# Altium schematic sheet POWER_DDR3.SchDoc
size Tabloid; SheetNumber: 22; SheetTotal: 25; Sheet_Name: DDR3 POWER; Size: 11x17
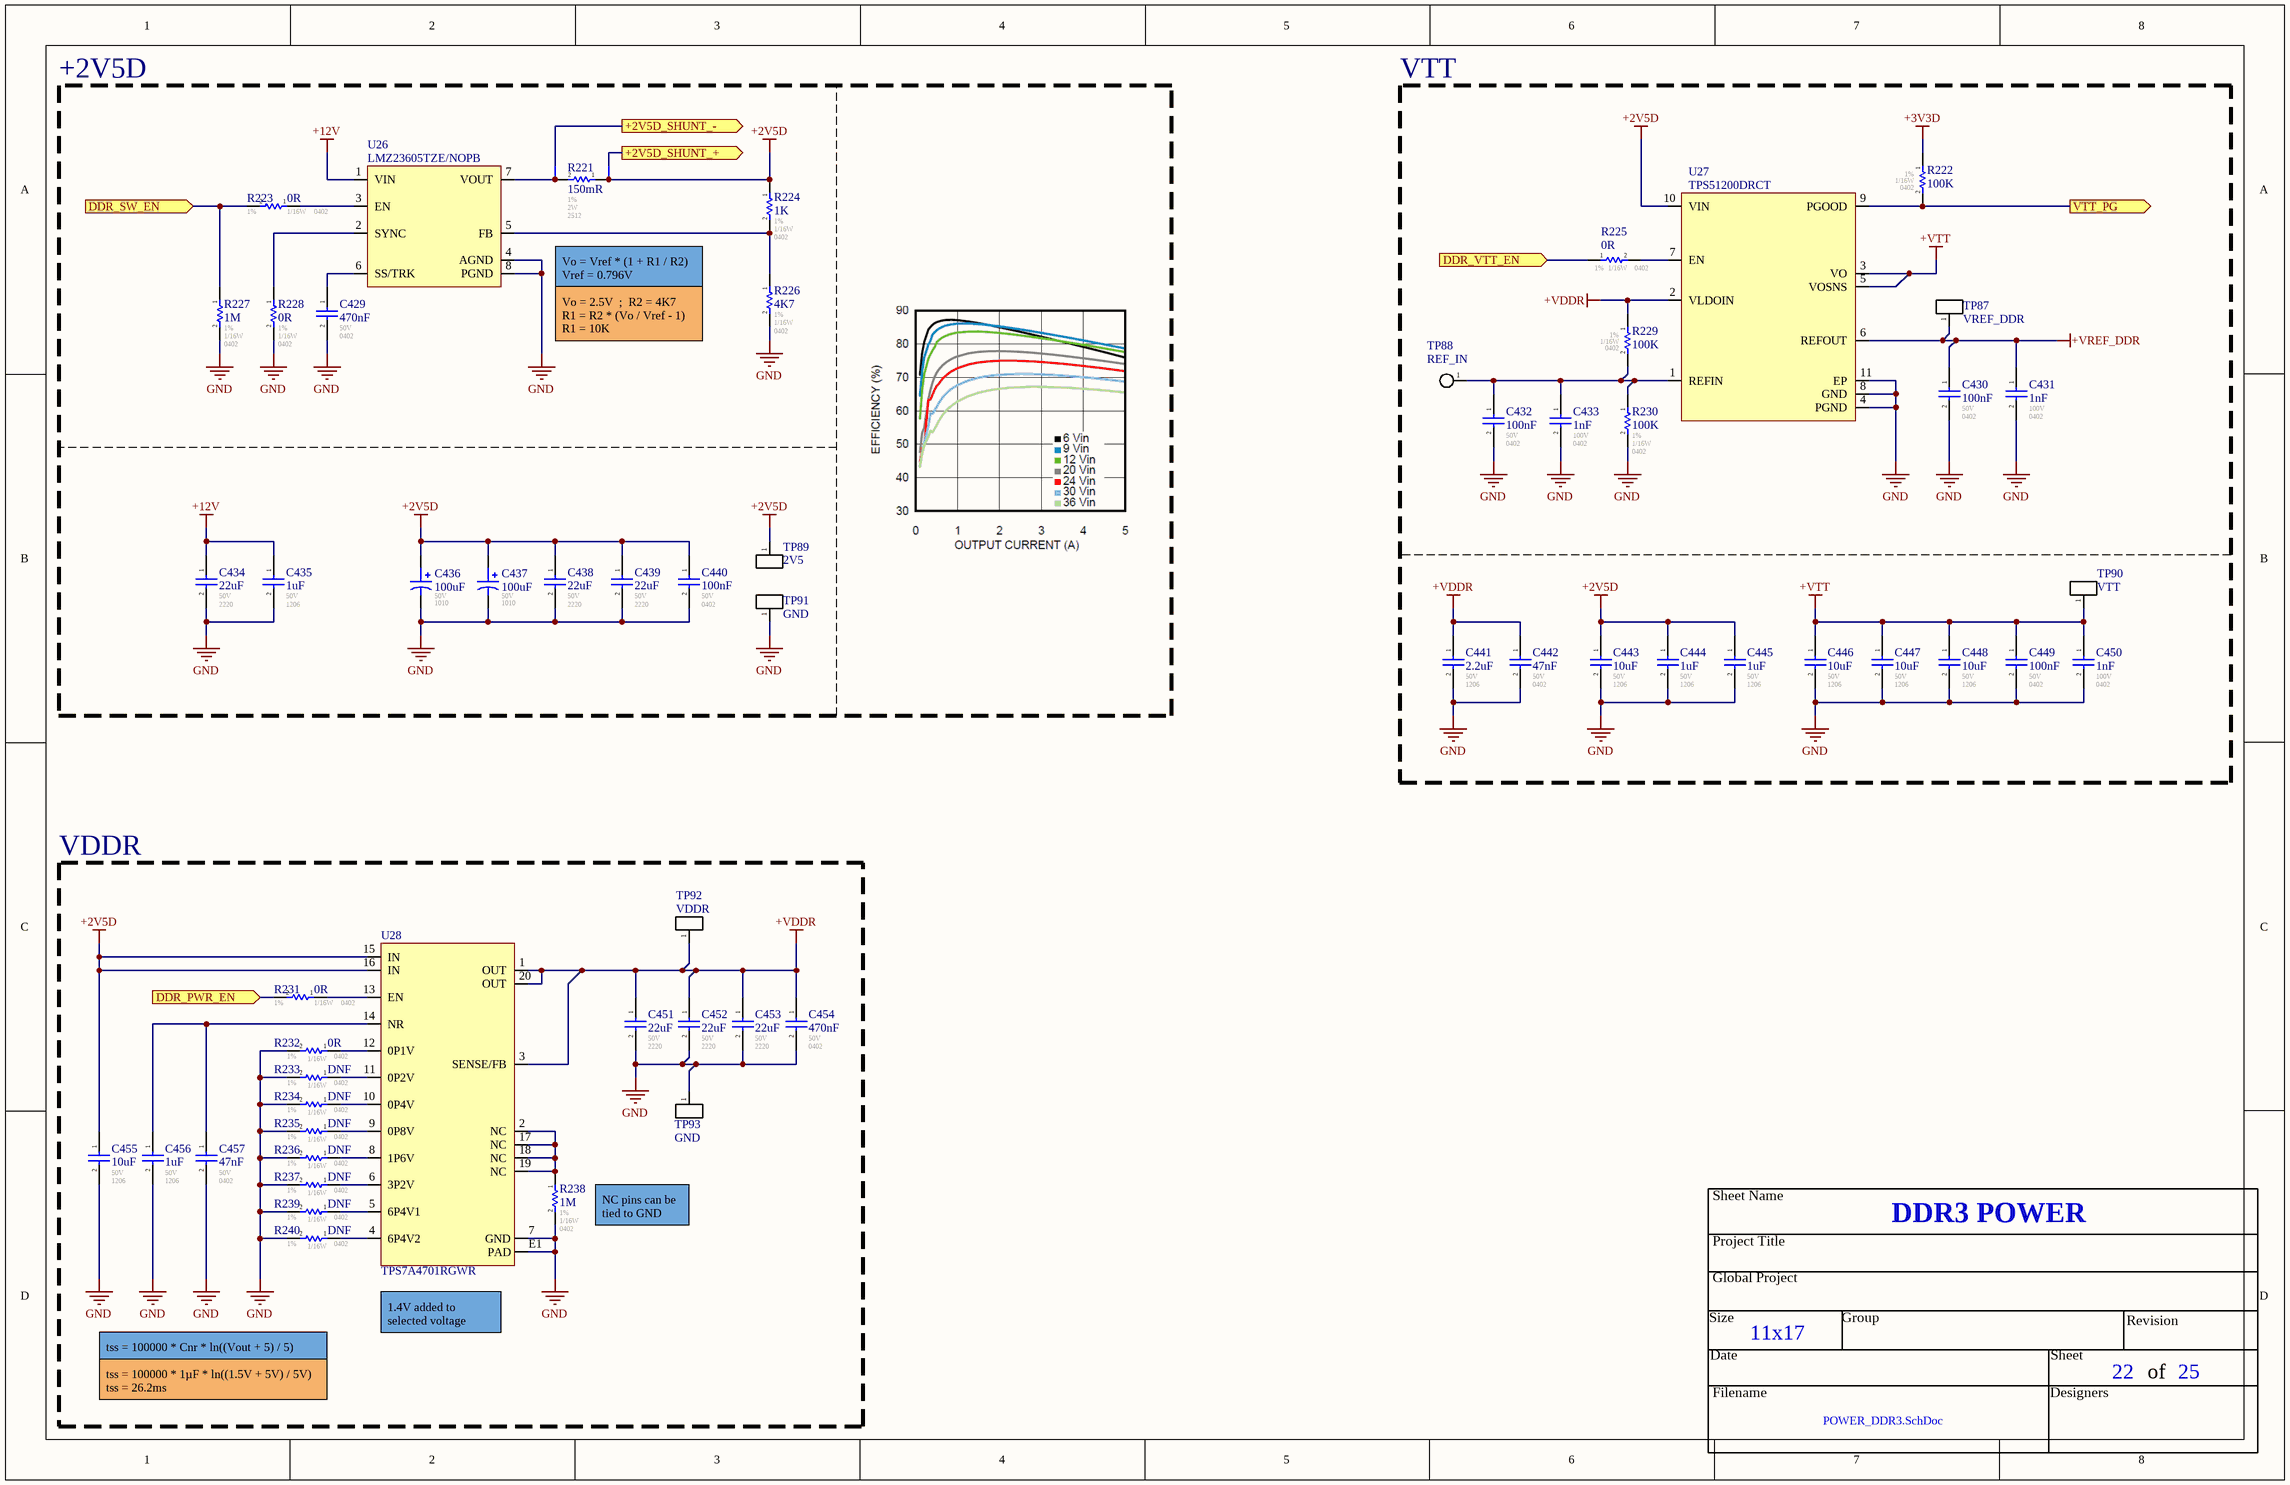
[diagram p0: POWER_DDR3.SchDoc]

## Parts
C429  470nF  Voltage - Rated: 50V  Footprint: 0402  [CAP_0402]
C430  100nF  Voltage - Rated: 50V  Footprint: 0402  [CAP_0402]
C431  1nF  Voltage - Rated: 100V  Footprint: 0402  [CAP_0402]
C432  100nF  Voltage - Rated: 50V  Footprint: 0402  [CAP_0402]
C433  1nF  Voltage - Rated: 100V  Footprint: 0402  [CAP_0402]
C434  22uF  Voltage - Rated: 50V  Footprint: 2220  [CAP_2220]
C435  1uF  Voltage - Rated: 50V  Footprint: 1206  [CAP_1206]
C436  value 100uF  Voltage: 50V  Package: 1010  [CAP_ALU_1010_vishay]  (hidden comment: MAL215099101E3)
C437  value 100uF  Voltage: 50V  Package: 1010  [CAP_ALU_1010_vishay]  (hidden comment: MAL215099101E3)
C438  22uF  Voltage - Rated: 50V  Footprint: 2220  [CAP_2220]
C439  22uF  Voltage - Rated: 50V  Footprint: 2220  [CAP_2220]
C440  100nF  Voltage - Rated: 50V  Footprint: 0402  [CAP_0402]
C441  2.2uF  Voltage - Rated: 50V  Footprint: 1206  [CAP_1206]
C442  47nF  Voltage - Rated: 50V  Footprint: 0402  [CAP_0402]
C443  10uF  Voltage - Rated: 50V  Footprint: 1206  [CAP_1206]
C444  1uF  Voltage - Rated: 50V  Footprint: 1206  [CAP_1206]
C445  1uF  Voltage - Rated: 50V  Footprint: 1206  [CAP_1206]
C446  10uF  Voltage - Rated: 50V  Footprint: 1206  [CAP_1206]
C447  10uF  Voltage - Rated: 50V  Footprint: 1206  [CAP_1206]
C448  10uF  Voltage - Rated: 50V  Footprint: 1206  [CAP_1206]
C449  100nF  Voltage - Rated: 50V  Footprint: 0402  [CAP_0402]
C450  1nF  Voltage - Rated: 100V  Footprint: 0402  [CAP_0402]
C451  22uF  Voltage - Rated: 50V  Footprint: 2220  [CAP_2220]
C452  22uF  Voltage - Rated: 50V  Footprint: 2220  [CAP_2220]
C453  22uF  Voltage - Rated: 50V  Footprint: 2220  [CAP_2220]
C454  470nF  Voltage - Rated: 50V  Footprint: 0402  [CAP_0402]
C455  10uF  Voltage - Rated: 50V  Footprint: 1206  [CAP_1206]
C456  1uF  Voltage - Rated: 50V  Footprint: 1206  [CAP_1206]
C457  47nF  Voltage - Rated: 50V  Footprint: 0402  [CAP_0402]
NT44  Net Tie  [NETTIE_5]  (value not drawn)  (net tie, no BOM)
NT45  Net Tie  [NETTIE_5]  (value not drawn)  (net tie, no BOM)
R221  150mR  Tolerance: 1%  Power: 2W  Package / Case: 2512  [RES_2512]
R222  100K  Tolerance: 1%  Power: 1/16W  Package / Case: 0402  [RES_0402]
R223  0R  Tolerance: 1%  Power: 1/16W  Package / Case: 0402  [RES_0402]
R224  1K  Tolerance: 1%  Power: 1/16W  Package / Case: 0402  [RES_0402]
R225  0R  Tolerance: 1%  Power: 1/16W  Package / Case: 0402  [RES_0402]
R226  4K7  Tolerance: 1%  Power: 1/16W  Package / Case: 0402  [RES_0402]
R227  1M  Tolerance: 1%  Power: 1/16W  Package / Case: 0402  [RES_0402]
R228  0R  Tolerance: 1%  Power: 1/16W  Package / Case: 0402  [RES_0402]
R229  100K  Tolerance: 1%  Power: 1/16W  Package / Case: 0402  [RES_0402]
R230  100K  Tolerance: 1%  Power: 1/16W  Package / Case: 0402  [RES_0402]
R231  0R  Tolerance: 1%  Power: 1/16W  Package / Case: 0402  [RES_0402]
R232  0R  Tolerance: 1%  Power: 1/16W  Package / Case: 0402  [RES_0402]
R233  DNF  Tolerance: 1%  Power: 1/16W  Package / Case: 0402  [RES_0402]
R234  DNF  Tolerance: 1%  Power: 1/16W  Package / Case: 0402  [RES_0402]
R235  DNF  Tolerance: 1%  Power: 1/16W  Package / Case: 0402  [RES_0402]
R236  DNF  Tolerance: 1%  Power: 1/16W  Package / Case: 0402  [RES_0402]
R237  DNF  Tolerance: 1%  Power: 1/16W  Package / Case: 0402  [RES_0402]
R238  1M  Tolerance: 1%  Power: 1/16W  Package / Case: 0402  [RES_0402]
R239  DNF  Tolerance: 1%  Power: 1/16W  Package / Case: 0402  [RES_0402]
R240  DNF  Tolerance: 1%  Power: 1/16W  Package / Case: 0402  [RES_0402]
TP87  VREF_DDR  [TP_HOLE]  (no BOM)
TP88  REF_IN  [TP_PAD_SMALL]  (no BOM)
TP89  2V5  [TP_HOLE]  (no BOM)
TP90  VTT  [TP_HOLE]  (no BOM)
TP91  GND  [TP_HOLE]  (no BOM)
TP92  VDDR  [TP_HOLE]  (no BOM)
TP93  GND  [TP_HOLE]  (no BOM)
U26  LMZ23605TZE/NOPB  [REG_SWR_LMZ23605TZE/NOPB]
U27  TPS51200DRCT  [REG_PMIC_TPS51200DRCT]
U28  TPS7A4701RGWR  [REG_TPS7A4701RGWR]

## Blocks framed on the sheet
+2V5D: C429 C434-C440 NT44 NT45 R221 R223 R224 R226-R228 TP89 TP91 U26
VTT: C430-C433 C441-C450 R222 R225 R229 R230 TP87 TP88 TP90 U27
VDDR: C451-C457 R231-R240 TP92 TP93 U28

## Ports
+2V5D_SHUNT_+ (out), +2V5D_SHUNT_- (out), DDR_PWR_EN (in), DDR_SW_EN (in), DDR_VTT_EN (in), VTT_PG (out)

## Nets
+2V5D: C436.1 C437.1 C438.1 C439.1 C440.1 C443.1 C444.1 C445.1 C455.1 NT45.1 R221.1 R224.1 TP89.1(A) U27.10(VIN) U28.15(IN) U28.16(IN)
+3V3D: R222.1
+12V: C434.1 C435.1 U26.1(VIN)
+VDDR: C441.1 C442.1 C451.1 C452.1 C453.1 C454.1 R229.1 TP92.1(A) U27.2(VLDOIN) U28.1(OUT) U28.3(SENSE/FB) U28.20(OUT)
+VREF_DDR: C430.1 C431.1 TP87.1(A) U27.6(REFOUT)
+VTT: C446.1 C447.1 C448.1 C449.1 C450.1 TP90.1(A) U27.3(VO) U27.5(VOSNS)
GND: C429.2 C430.2 C431.2 C432.2 C433.2 C434.2 C435.2 C436.2 C437.2 C438.2 C439.2 C440.2 C441.2 C442.2 C443.2 C444.2 C445.2 C446.2 C447.2 C448.2 C449.2 C450.2 C451.2 C452.2 C453.2 C454.2 C455.2 C456.2 C457.2 R226.2 R227.2 R228.2 R230.2 R232.2 R233.2 R234.2 R235.2 R236.2 R237.2 R238.2 R239.2 R240.2 TP91.1(A) TP93.1(A) U26.4(AGND) U26.8(PGND) U27.4(PGND) U27.8(GND) U27.11(EP) U28.7(GND) U28.E1(PAD)
+2V5D_SHUNT_+: NT45.2 ; port +2V5D_SHUNT_+
+2V5D_SHUNT_-: NT44.2 ; port +2V5D_SHUNT_-
DDR_PWR_EN: R231.2 ; port DDR_PWR_EN
DDR_SW_EN: R223.2 R227.1 ; port DDR_SW_EN
DDR_VTT_EN: R225.1 ; port DDR_VTT_EN
VTT_PG: R222.2 U27.9(PGOOD) ; port VTT_PG
NetC429_1: C429.1 U26.6(SS/TRK)
NetC432_1: C432.1 C433.1 R229.2 R230.1 TP88.1(A) U27.1(REFIN)
NetC456_1: C456.1 C457.1 U28.14(NR)
NetNT44_1: NT44.1 R221.2 U26.7(VOUT)
NetR223_1: R223.1 U26.3(EN)
NetR224_2: R224.2 R226.1 U26.5(FB)
NetR225_2: R225.2 U27.7(EN)
NetR228_1: R228.1 U26.2(SYNC)
NetR231_1: R231.1 U28.13(EN)
NetR232_1: R232.1 U28.12(0P1V)
NetR233_1: R233.1 U28.11(0P2V)
NetR234_1: R234.1 U28.10(0P4V)
NetR235_1: R235.1 U28.9(0P8V)
NetR236_1: R236.1 U28.8(1P6V)
NetR237_1: R237.1 U28.6(3P2V)
NetR238_1: R238.1 U28.2(NC) U28.17(NC) U28.18(NC) U28.19(NC)
NetR239_1: R239.1 U28.5(6P4V1)
NetR240_1: R240.1 U28.4(6P4V2)

## Notes on the sheet
- Vo = Vref * (1 + R1 / R2)
  Vref = 0.796V
- Vo = 2.5V  ;  R2 = 4K7
  R1 = R2 * (Vo / Vref - 1)
  R1 = 10K
- (near R238) NC pins can be tied to GND
- tss = 100000 * Cnr * ln((Vout + 5) / 5)
- (near U28) 1.4V added to selected voltage
- tss = 100000 * 1µF * ln((1.5V + 5V) / 5V)
  tss = 26.2ms
- Sheet Name
- Project Title
- Global Project
- Revision
- Size
- Date
- Group
- Sheet
- of
- Filename
- Designers

## Library data of the parts
C429 C454 = CAP_CER: CGA3E3X7R1H474K080AB / 0603 470nF 10% X7R Ceramic Capacitor; Mfr: TDK; Operating Temperature: -55C - 125C; Temperature Coefficient: X7R; ComponentLink1Description: Digikey; ComponentLink1URL: [Digikey Link]; Part#: CGA3E3X7R1H474K080AB; ComponentLink2Description: Datasheet; ComponentLink2URL: [Datasheet Link]; Tolerance: 10%; Ratings: AEC-Q200
C430 C432 C440 C449 = CAP_CER: GCM155R71H104KE02J / 0402 100nF 10% X7R Ceramic Capacitor; Mfr: Murata; Operating Temperature: -55C - 125C; Temperature Coefficient: X7R; ComponentLink1Description: Digikey; ComponentLink1URL: [Digikey Link]; Part#: GCM155R71H104KE02J; ComponentLink2Description: Datasheet; ComponentLink2URL: [Datasheet Link]; Tolerance: 10%; Ratings: AEC-Q200
C431 C433 C450 = CAP_CER: GCM155R72A102KA37D / 0402 1nF 10% X7R Ceramic Capacitor; Mfr: Murata; Operating Temperature: -55C - 125C; Temperature Coefficient: X7R; ComponentLink1Description: Digikey; ComponentLink1URL: [Digikey Link]; Part#: GCM155R72A102KA37D; ComponentLink2Description: Datasheet; ComponentLink2URL: [Datasheet Link]; Tolerance: 10%; Ratings: AEC-Q200
C434 C438 C439 C451-C453 = CAP_CER: CGA9P3X7R1H226M250KB / 2220 22uF 20% X7R Ceramic Capacitor; Mfr: TDK; Operating Temperature: -55C - 125C; Temperature Coefficient: X7R; ComponentLink1Description: Digikey; ComponentLink1URL: https://www.digikey.ca/en/products/detail/tdk-corporation/CGA9P3X7R1H226M250KB/10240627; ComponentLink2Description: Datasheet; ComponentLink2URL: https://product.tdk.com/system/files/dam/doc/product/capacitor/ceramic/mlcc/charasheet/cga9p3x7r1h226m250kb.pdf; Tolerance: 20%; Ratings: AEC-Q200; Part#: CGA9P3X7R1H226M250KB; Supplier 1: Arrow Electronics; Supplier Part Number 1: CGA9P3X7R1H226M250KB; ComponentLink3Description: TDK; ComponentLink3URL: https://product.tdk.com/en/search/capacitor/ceramic/mlcc/info?part_no=CGA9P3X7R1H226M250KB; ComponentLink4Description: Octopart; ComponentLink4URL: https://octopart.com/cga9p3x7r1h226m250kb-tdk-102764996?r=sp
C435 C444 C445 C456 = CAP_CER: GCJ31CR71H105KA12L / 1206 1uF 10% X7R Ceramic Capacitor; Mfr: Murata; Operating Temperature: -55C - 125C; Temperature Coefficient: X7R; ComponentLink1Description: Digikey; ComponentLink1URL: [Digikey Link]; Part#: GCJ31CR71H105KA12L; ComponentLink2Description: Datasheet; ComponentLink2URL: [Datasheet Link]; Tolerance: 10%; Ratings: AEC-Q200
C436 C437 = CAP_ALU_MAL215099101E3: CAP - ALU 100uF 20% 50V - 1010; Current: 490mA; Mfg: Vishay Dale; Mfg Part Number: MAL215099101E3; HelpURL: http://www.vishay.com/docs/28395/150crz.pdf; CreatedBy: Jonathan Bouchard; Temperature: -55°C to 125°C; Power: *; Supplier 1: Digikey; Supplier Part Number 1: 4399PHDKR-ND; Precision: 20%
C441 = CAP_CER: GRT31CR71H225KE13L / 1206 2.2uF 10% X7R Ceramic Capacitor; Mfr: Murata; Operating Temperature: -55C - 125C; Temperature Coefficient: X7R; ComponentLink1Description: Digikey; ComponentLink1URL: https://www.digikey.ca/en/products/detail/murata-electronics/GRT31CR71H225KE13L/10700891; Part#: GRT31CR71H225KE13L; ComponentLink2Description: Datasheet; ComponentLink2URL: https://search.murata.co.jp/Ceramy/image/img/A01X/G101/ENG/GRT31CR71H225KE13-01A.pdf; ComponentLink3Description: Octopart; ComponentLink3URL: https://octopart.com/grt31cr71h225ke13l-murata-76584457?r=sp; ComponentLink4Description: Murata; ComponentLink4URL: https://www.murata.com/en-us/products/productdetail?partno=GRT31CR71H225KE13%23; Tolerance: 10%; Ratings: AEC-Q200
C442 C457 = CAP_CER: GCM155R71H473KE02J / 0402 47nF 10% X7R Ceramic Capacitor; Mfr: Murata; Operating Temperature: -55C - 125C; Temperature Coefficient: X7R; ComponentLink1Description: Digikey; ComponentLink1URL: [Digikey Link]; Part#: GCM155R71H473KE02J; ComponentLink2Description: Datasheet; ComponentLink2URL: [Datasheet Link]; Tolerance: 10%; Ratings: AEC-Q200
C443 C446-C448 C455 = CAP_CER: GRT31CR61H106KE01L / 1206 10uF 10% X5R Ceramic Capacitor; Mfr: Murata; Operating Temperature: -55C - 85C; Temperature Coefficient: X5R; ComponentLink1Description: Digikey; ComponentLink1URL: [Digikey Link]; ComponentLink2Description: Datasheet; ComponentLink2URL: [Datasheet Link]; Tolerance: 10%; Ratings: AEC-Q200; Supplier 1: Arrow Electronics; Supplier Part Number 1: GRT31CR61H106KE01L; Part#: GRT31CR61H106KE01L
NT44 NT45 = NET_TIE_SMALL
R221 = RESISTOR: CSRN2512FKR150; Automotive: AEC-Q200; Operating Temperature: -55C - 155C; ComponentLink1Description: Digikey; ComponentLink1URL: https://www.digikey.ca/fr/products/detail/stackpole-electronics-inc/CSRN2512FKR150/1788109; Part #: CSRN2512FKR150
R222-R226 R228-R237 R239 R240 = RESISTOR: Automotive: AEC-Q200; Operating Temperature: *; # Digikey: *; ComponentLink1Description: Digikey; ComponentLink1URL: *; # Manufacturer: *
R227 R238 = RESISTOR: 1M 0402 1% 1/16W Resistor; Automotive: AEC-Q200; Operating Temperature: *; # Digikey: *; ComponentLink1Description: Digikey; ComponentLink1URL: *; # Manufacturer: *
TP87 TP89-TP93 = TESTPOINT: Test Point; ClassName: Testpoint
TP88 = TESTPOINT_PAD_SMALL: Test Point
U26 = REG_SWR_LMZ23605TZE/NOPB: REG - IC BUCK SYNC 36V 5A - TO-PMOD-7; Manufacturer #1: Texas Instruments; Value: 0.8 ~ 6 V; Voltage Rating: 6 ~ 36 V; GRAMS Lib Spec: 2.8; Note: One Reflow; Magnetic Material: YES; Cryo: UNKNOWN; Tolerance: *; Current Rating: 5A; Power Max: *; HelpURL: http://www.ti.com/lit/ds/symlink/lmz23605.pdf; CreatedBy/Date: Arnaud Samson - 05/07/18; VerifiedBy: Jonathan Bouchard 2018-07-13; Temperature: -40°C ~ 125°C; Package: TO-PMOD-7; Manufacturer #2: *; Assembly Type: SMD; Part Number #2: *; Part Number #1: LMZ23605TZE/NOPB; Polarized: YES; Supplier 1: Digi-Key; Supplier Part Number 1: 296-35357-1-ND
U27 = REG_PMIC_TPS51200DRCT: REG - DDR TERMINATION/REF REG - 10-VFDFN; Manufacturer #1: Texas Instruments; Value: DDR, DDR2, DDR3(L), DDR4; Voltage Rating: 2.375V ~ 3.5V; Current Rating: Source: 3A~4.5A, Sink: 3.5A~5.5A; GRAMS Lib Spec: 2.8; Magnetic Material: Unknown; Polarized: Yes; Tolerance: *; Power Max: *; HelpURL: http://www.ti.com/lit/ds/symlink/tps51200.pdf; CreatedBy/Date: Joel Lemay 2019-03-19; VerifiedBy: Nicolas V. (2019-05-31); Temperature: -40°C ~ 85°C; Package: 10-VFDFN; Manufacturer #2: *; Note: *; Assembly Type: SMD; Part Number #2: *; Part Number #1: TPS51200DRCT; Supplier 1: Digi-Key; Supplier Part Number 1: 296-23830-1-ND; Cryo: UNKNOWN
U28 = REG_LDO_TPS7A4701RGWR: REG - LINEAR POS ADJ 1A - 20VQFN; Manufacturer #1: Texas Instruments; GRAMS Lib Spec: 2.8; Magnetic Material: Unknown; Polarized: Yes; Value: 1.4 à 34V; Voltage rating: 35V max; Assembly Type: SMD; CreatedBy/Date: L-P Gauthier / 2018-05-29; Current Rating: 1A; Manufacturer #2: TBD; Part Number #1: TPS7A4701RGWR; Part Number #2: TBD; Package: 20-VQFN Exposed Pad; Power Max: *; Tolerance: -; Supplier 1: Digi-Key; Supplier Part Number 1: 296-37224-1-ND; VerifiedBy: Caroline Paulin - 28 sept 2018; Temperature: -40°C ~ 125°C; HelpURL: http://www.ti.com/lit/ds/symlink/tps7a47.pdf; Cryo: UNKNOWN